# Altium schematic sheet CAN.SchDoc
size A3; SheetNumber: 3; SheetTotal: 6
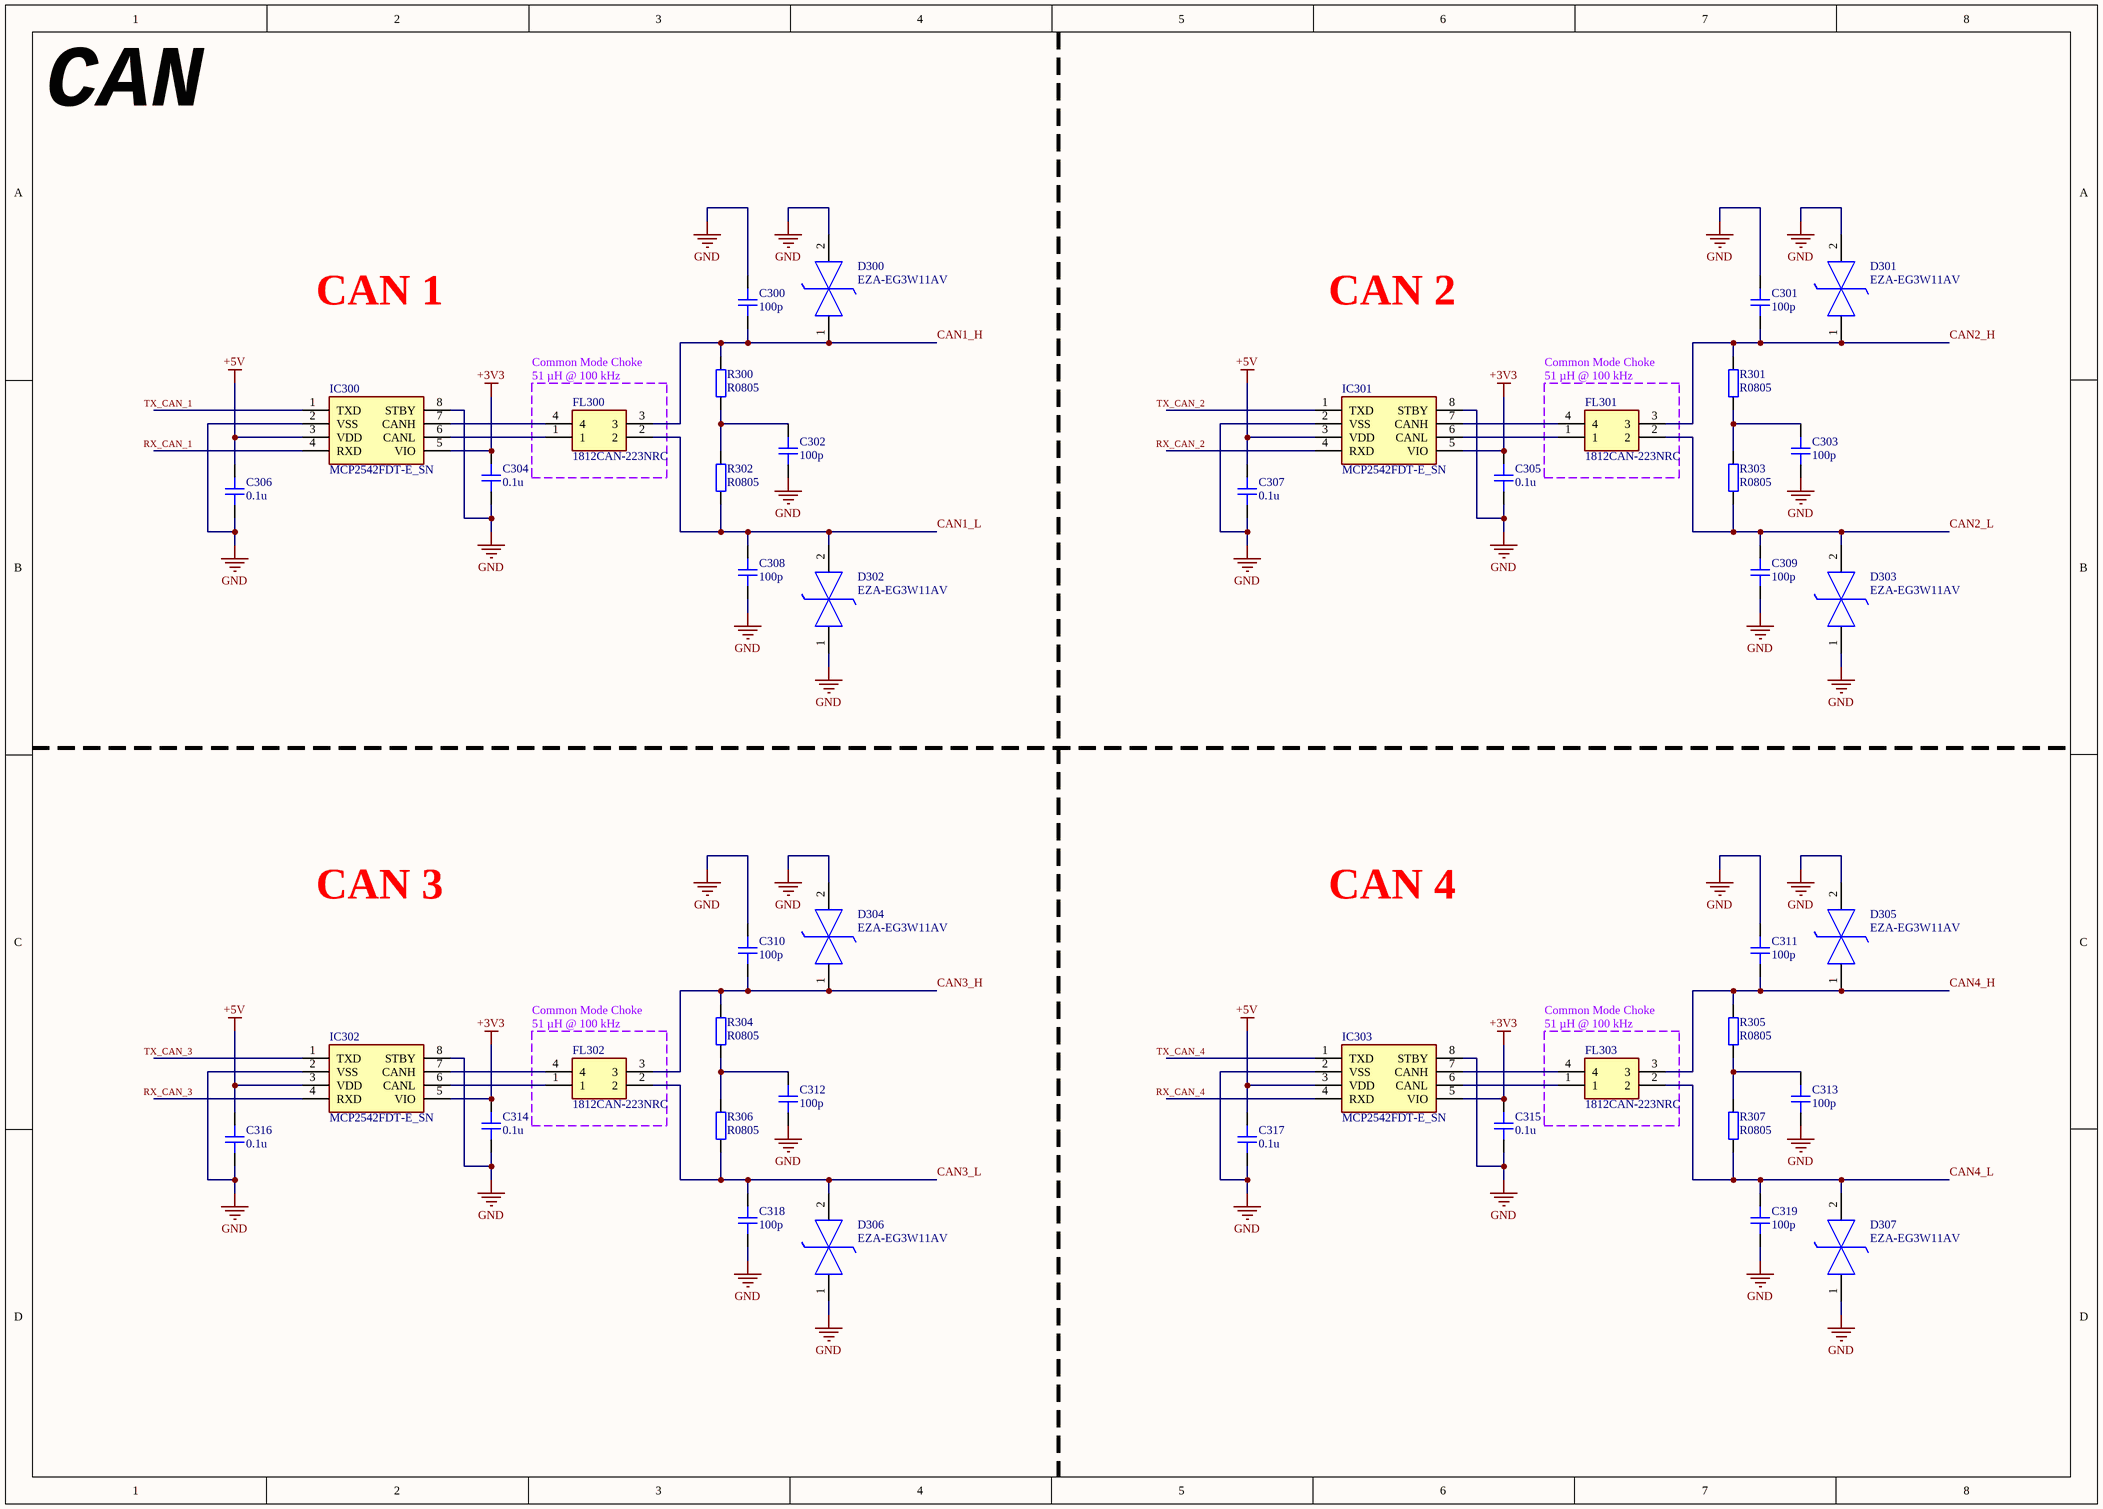
[diagram p0: CAN.SchDoc]

## Parts
C300  100p  [CAP_0805]
C301  100p  [CAP_0805]
C302  100p  [CAP_0805]
C303  100p  [CAP_0805]
C304  0.1u  [CAP_0805]
C305  0.1u  [CAP_0805]
C306  0.1u  [CAP_0805]
C307  0.1u  [CAP_0805]
C308  100p  [CAP_0805]
C309  100p  [CAP_0805]
C310  100p  [CAP_0805]
C311  100p  [CAP_0805]
C312  100p  [CAP_0805]
C313  100p  [CAP_0805]
C314  0.1u  [CAP_0805]
C315  0.1u  [CAP_0805]
C316  0.1u  [CAP_0805]
C317  0.1u  [CAP_0805]
C318  100p  [CAP_0805]
C319  100p  [CAP_0805]
D300  EZA-EG3W11AV  [EZAEG3W11AV]
D301  EZA-EG3W11AV  [EZAEG3W11AV]
D302  EZA-EG3W11AV  [EZAEG3W11AV]
D303  EZA-EG3W11AV  [EZAEG3W11AV]
D304  EZA-EG3W11AV  [EZAEG3W11AV]
D305  EZA-EG3W11AV  [EZAEG3W11AV]
D306  EZA-EG3W11AV  [EZAEG3W11AV]
D307  EZA-EG3W11AV  [EZAEG3W11AV]
FL300  1812CAN-223NRC  [1812CAN223NRC]
FL301  1812CAN-223NRC  [1812CAN223NRC]
FL302  1812CAN-223NRC  [1812CAN223NRC]
FL303  1812CAN-223NRC  [1812CAN223NRC]
IC300  MCP2542FDT-E_SN  [SOIC127P600X175-8N]
IC301  MCP2542FDT-E_SN  [SOIC127P600X175-8N]
IC302  MCP2542FDT-E_SN  [SOIC127P600X175-8N]
IC303  MCP2542FDT-E_SN  [SOIC127P600X175-8N]
R300  R0805  [RES_0805]
R301  R0805  [RES_0805]
R302  R0805  [RES_0805]
R303  R0805  [RES_0805]
R304  R0805  [RES_0805]
R305  R0805  [RES_0805]
R306  R0805  [RES_0805]
R307  R0805  [RES_0805]

## Nets
+3V3: C304.2 C305.2 C314.2 C315.2 IC300.5(VIO) IC301.5(VIO) IC302.5(VIO) IC303.5(VIO)
+5V: C306.2 C307.2 C316.2 C317.2 IC300.3(VDD) IC301.3(VDD) IC302.3(VDD) IC303.3(VDD)
GND: C300.1 C301.1 C302.2 C303.2 C304.1 C305.1 C306.1 C307.1 C308.2 C309.2 C310.1 C311.1 C312.2 C313.2 C314.1 C315.1 C316.1 C317.1 C318.2 C319.2 D300.2(K2) D301.2(K2) D302.1(K1) D303.1(K1) D304.2(K2) D305.2(K2) D306.1(K1) D307.1(K1) IC300.2(VSS) IC300.8(STBY) IC301.2(VSS) IC301.8(STBY) IC302.2(VSS) IC302.8(STBY) IC303.2(VSS) IC303.8(STBY)
CAN1_H: C300.2 D300.1(K1) FL300.3 R300.2
CAN1_L: C308.1 D302.2(K2) FL300.2 R302.1
CAN2_H: C301.2 D301.1(K1) FL301.3 R301.2
CAN2_L: C309.1 D303.2(K2) FL301.2 R303.1
CAN3_H: C310.2 D304.1(K1) FL302.3 R304.2
CAN3_L: C318.1 D306.2(K2) FL302.2 R306.1
CAN4_H: C311.2 D305.1(K1) FL303.3 R305.2
CAN4_L: C319.1 D307.2(K2) FL303.2 R307.1
RX_CAN_1: IC300.4(RXD)
RX_CAN_2: IC301.4(RXD)
RX_CAN_3: IC302.4(RXD)
RX_CAN_4: IC303.4(RXD)
TX_CAN_1: IC300.1(TXD)
TX_CAN_2: IC301.1(TXD)
TX_CAN_3: IC302.1(TXD)
TX_CAN_4: IC303.1(TXD)
NetC302_1: C302.1 R300.1 R302.2
NetC303_1: C303.1 R301.1 R303.2
NetC312_1: C312.1 R304.1 R306.2
NetC313_1: C313.1 R305.1 R307.2
NetFL300_1: FL300.1 IC300.6(CANL)
NetFL300_4: FL300.4 IC300.7(CANH)
NetFL301_1: FL301.1 IC301.6(CANL)
NetFL301_4: FL301.4 IC301.7(CANH)
NetFL302_1: FL302.1 IC302.6(CANL)
NetFL302_4: FL302.4 IC302.7(CANH)
NetFL303_1: FL303.1 IC303.6(CANL)
NetFL303_4: FL303.4 IC303.7(CANH)

## Notes on the sheet
- CAN
- CAN 1
- CAN 2
- (near FL300) Common Mode Choke
  51 µH @ 100 kHz
- (near FL301) Common Mode Choke
  51 µH @ 100 kHz
- CAN 3
- CAN 4
- (near FL302) Common Mode Choke
  51 µH @ 100 kHz
- (near FL303) Common Mode Choke
  51 µH @ 100 kHz

## Library data of the parts
C300-C319 = CAP_0805_10V: Capacitor SMD 0805 10V
D300-D307 = EZA-EG3W11AV: Diode ESD (Bi-directional); Manufacturer_Name: Panasonic; Datasheet Link: https://industrial.panasonic.com/cdbs/www-data/pdf/AWD0000/AWD0000C26.pdf; Height: 0.5mm; Manufacturer_Part_Number: EZA-EG3W11AV; Mouser Part Number: 667-EZA-EG3W11AV; Mouser Price/Stock: https://www.mouser.co.uk/ProductDetail/Panasonic/EZA-EG3W11AV?qs=0lSvoLzn4L%252BhlS%252B2lqbWqw%3D%3D; Arrow Part Number: EZA-EG3W11AV; Arrow Price/Stock: https://www.arrow.com/en/products/eza-eg3w11av/panasonic; Simulation Data: https://industrial.panasonic.com/content/data/CC/files/EZAEG3W11AV.zip
FL300-FL303 = 1812CAN-223NRC: Filter; Manufacturer_Name: COILCRAFT; Datasheet Link: https://www.coilcraft.com/getmedia/07970769-ca48-411d-9c96-6ae867bbb31e/1812can.pdf; Height: 3mm; Manufacturer_Part_Number: 1812CAN-223NRC; Mouser Part Number: 994-1812CAN-223NRC; Mouser Price/Stock: https://www.mouser.co.uk/ProductDetail/Coilcraft/1812CAN-223NRC?qs=wnTfsH77Xs58ULcmqHaGYA%3D%3D
IC300-IC303 = MCP2542FDT-E_SN: Integrated Circuit; Manufacturer_Name: Microchip; Manufacturer_Part_Number: MCP2542FDT-E/SN; Datasheet Link: https://ww1.microchip.com/downloads/en/DeviceDoc/MCP2542FD-MCP2542WFD-4WFD-Data-Sheet-DS20005514C.pdf; Height: 1.75mm; Mouser Part Number: 579-MCP2542FDT-E/SN; Mouser Price/Stock: https://www.mouser.co.uk/ProductDetail/Microchip-Technology-Atmel/MCP2542FDT-E-SN?qs=qdgZG5p0FZ7dgTYBMrlrQQ%3D%3D; Arrow Part Number: MCP2542FDT-E/SN; Arrow Price/Stock: https://www.arrow.com/en/products/mcp2542fdt-esn/microchip-technology?region=nac
R300-R307 = RES_0805: Resistor SMD 0805; Manufacturer: *; Manufacturer Part Number: *; Distributor Link: *; LCSC: *